# EasyEDA Pro project cameraboardschematic.epro

# Schematic CameraBoardSchematic
Board Name: 1 CameraBoard; Create Date: 2026-05-12; Page Name: P1; Project Name: To The Moon Together - An Amateur Sounding Rocket; Schematic Name: CameraBoardSchematic; Update Date: 2026-05-12; Company: EasyEDA.com; Page Size: A4; Version: V1.0
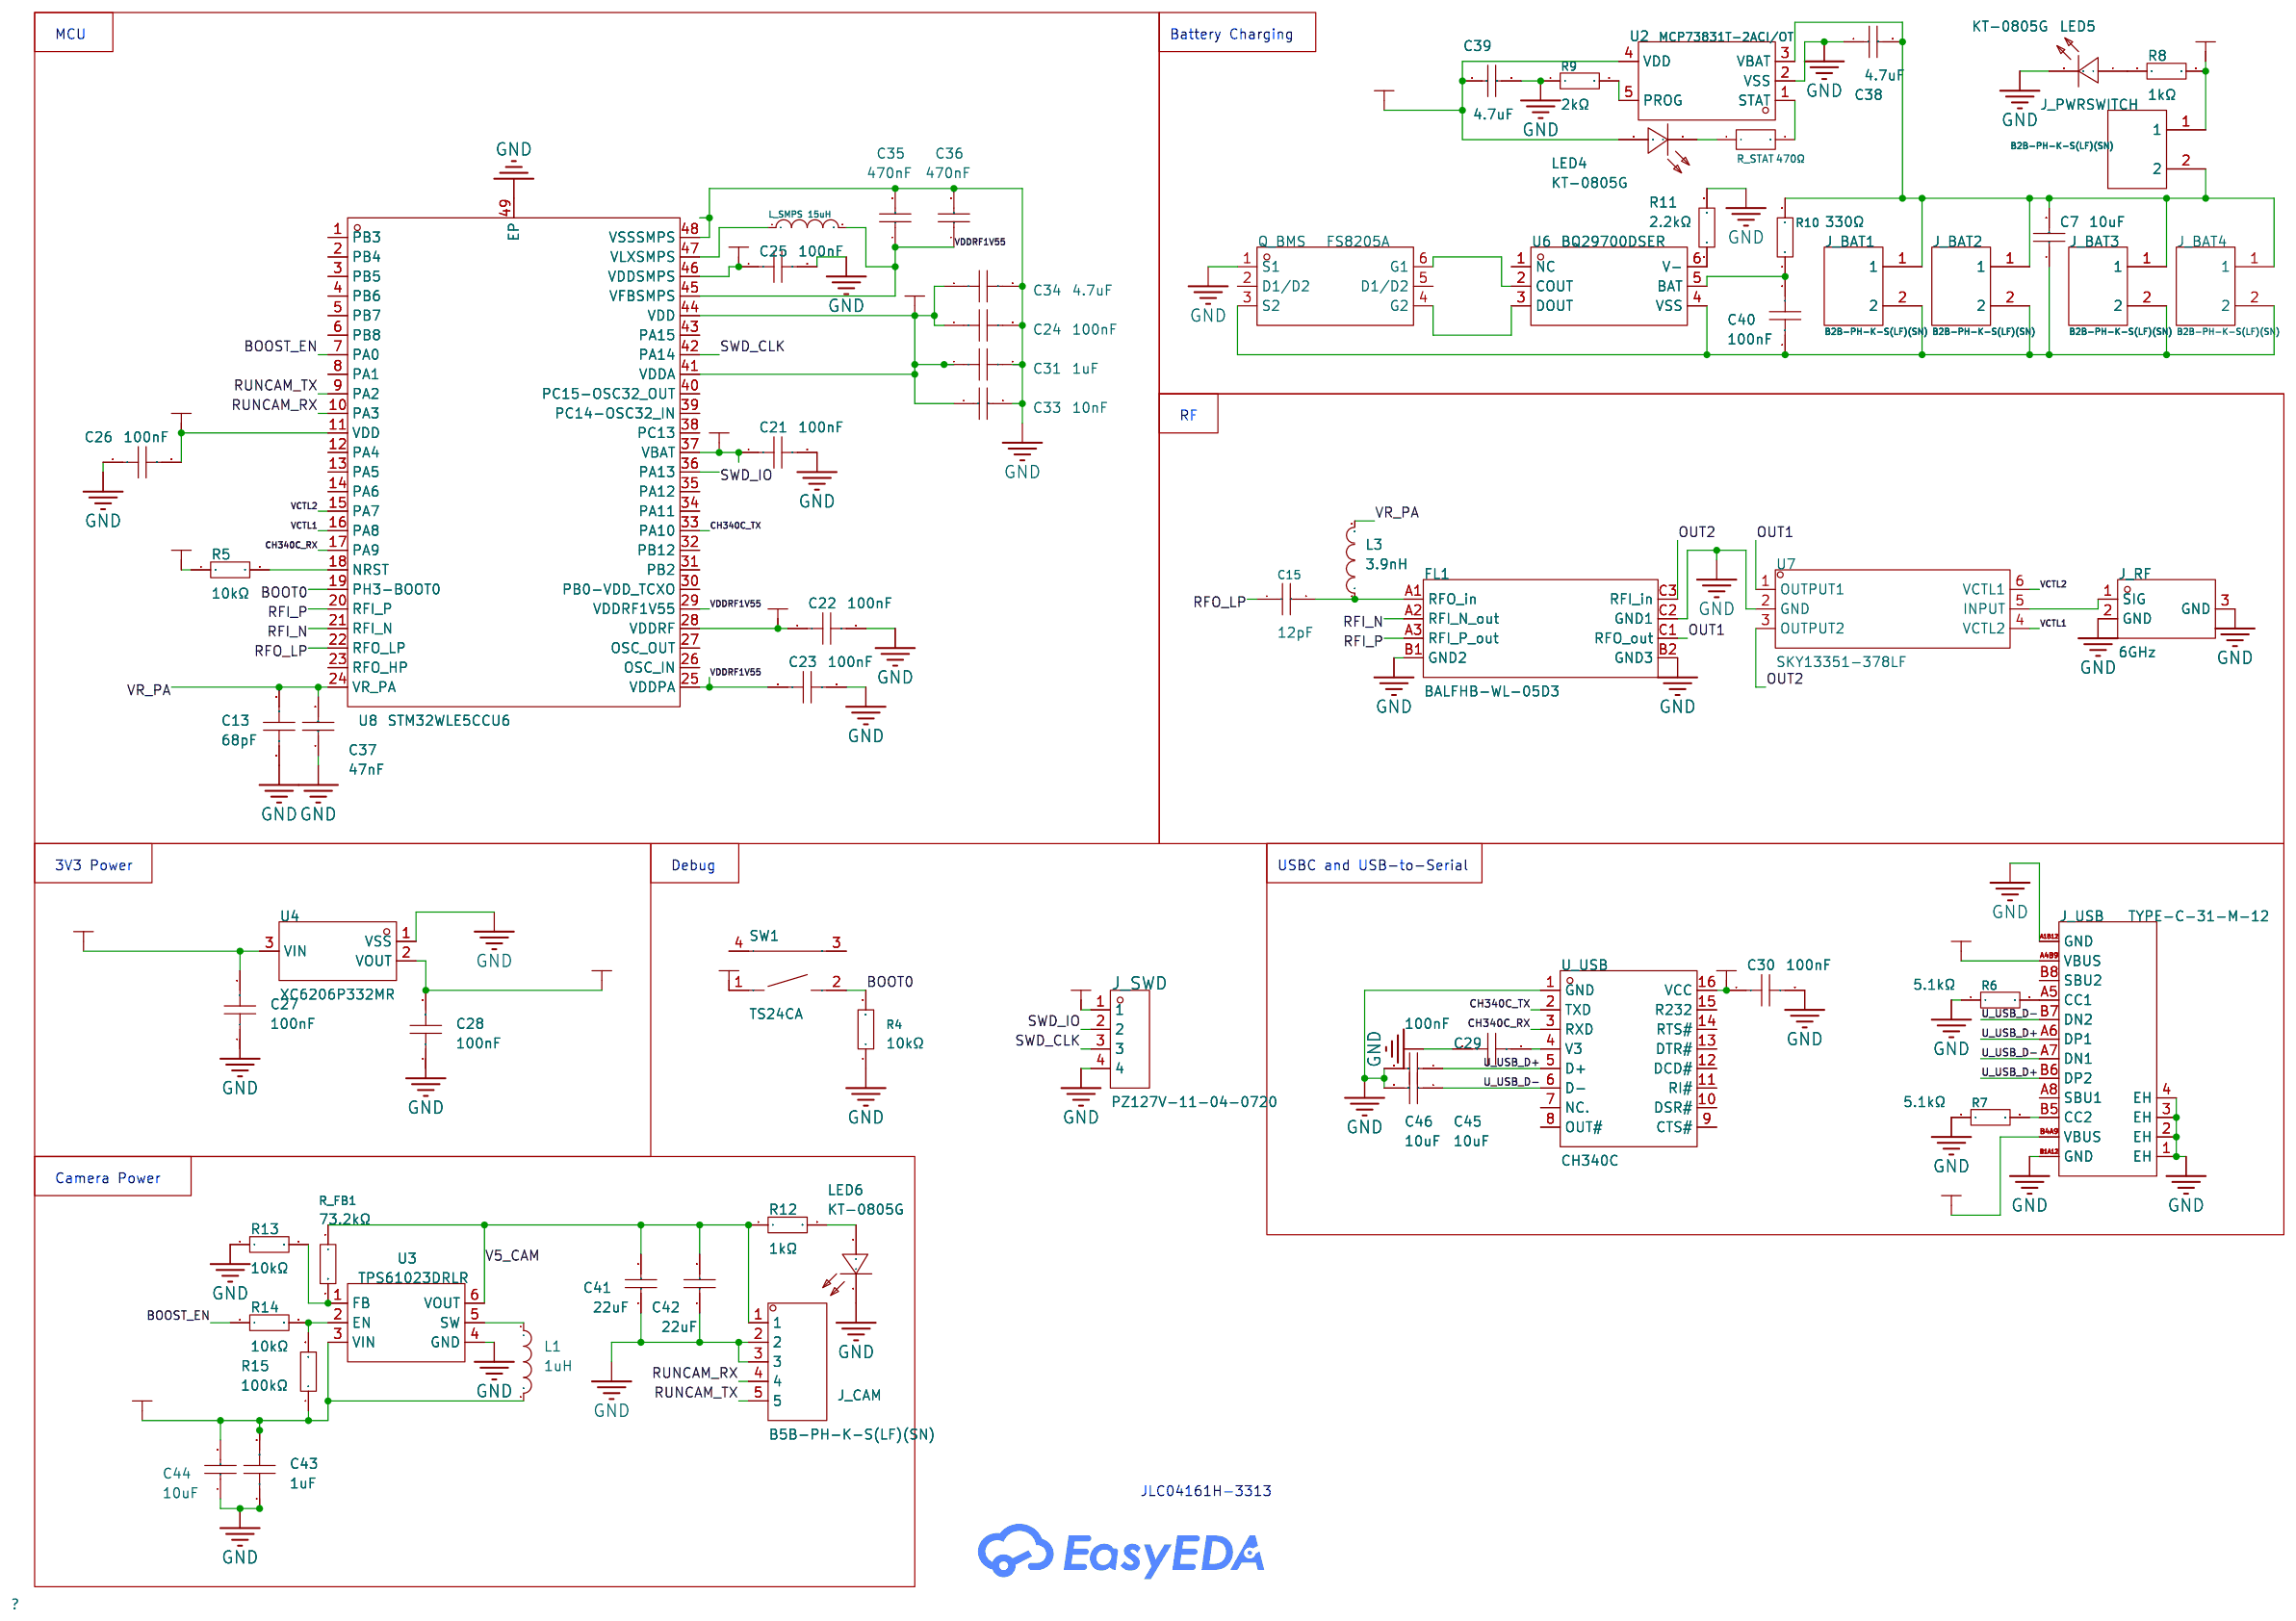
[diagram p0: schematic sheet]

## Parts
C7  10uF  [C0402]
C13  68pF  [C0402]
C15  12pF  [C0402]  (no BOM)
C21  100nF  [C0402]
C22  100nF  [C0402]
C23  100nF  [C0402]
C24  100nF  [C0402]
C25  100nF  [C0402]
C26  100nF  [C0402]
C27  100nF  [C0402]
C28  100nF  [C0402]
C29  100nF  [C0402]
C30  100nF  [C0402]
C31  1uF  [C0402]
C33  10nF  [C0402]
C34  4.7uF  [C0402]
C35  470nF  [C0603]
C36  470nF  [C0603]
C37  47nF  [C0402]
C38  4.7uF  [C1206]
C39  4.7uF  [C1206]
C40  100nF  [C0402]
C41  22uF  [C1206]
C42  22uF  [C1206]
C43  1uF  [C0402]
C44  10uF  [C0402]
C45  10uF  [C0402]
C46  10uF  [C0402]
FL1  BALFHB-WL-05D3  [CSPG-8_L2.1-W1.8_BALFHB-WL-03D3]
J_BAT1  B2B-PH-K-S(LF)(SN)  [CONN-TH_B2B-PH-K-S]
J_BAT2  B2B-PH-K-S(LF)(SN)  [CONN-TH_B2B-PH-K-S]
J_BAT3  B2B-PH-K-S(LF)(SN)  [CONN-TH_B2B-PH-K-S]
J_BAT4  B2B-PH-K-S(LF)(SN)  [CONN-TH_B2B-PH-K-S]
J_CAM  B5B-PH-K-S(LF)(SN)  [CONN-TH_B5B-PH-K-S-LF-SN]
J_PWRSWITCH  B2B-PH-K-S(LF)(SN)  [CONN-TH_B2B-PH-K-S]
J_RF  6GHz  [IPEX-SMD_BWIPX-1-001E]
J_SWD  PZ127V-11-04-0720  [HDR-TH_4P-P1.27-V-M]
J_USB  TYPE-C-31-M-12  [USB-C_SMD-TYPE-C-31-M-12_1]
L1  1uH  [L0603]
L3  3.9nH  [IND-SMD_L1.0-W0.5-2]  (no BOM)
L_SMPS  15uH  [IND-SMD_L2.5-W2.0]
LED4  KT-0805G  [LED0805-R-RD]
LED5  KT-0805G  [LED0805-R-RD]
LED6  KT-0805G  [LED0805-R-RD]
Q_BMS  FS8205A  [SOT-23-6_L2.9-W1.6-P0.95-LS2.8-BR]
R4  10kΩ  [R0402]
R5  10kΩ  [R0402]
R6  5.1kΩ  [R0402]
R7  5.1kΩ  [R0402]
R8  1kΩ  [R0402]
R9  2kΩ  [R0402]
R10  330Ω  [R0805]
R11  2.2kΩ  [R0805]
R12  1kΩ  [R0402]
R13  10kΩ  [R0402]
R14  10kΩ  [R0402]
R15  100kΩ  [R1206]
R_FB1  73.2kΩ  [R0402]
R_STAT  470Ω  [R0402]
SW1  TS24CA  [SW-SMD_2P-TS24CA]
U2  MCP73831T-2ACI/OT  [SOT-23-5_L3.0-W1.7-P0.95-LS2.8-BL]
U3  TPS61023DRLR  [SOT-563_L1.6-W1.2-P0.50-LS1.6-BR]
U4  XC6206P332MR  [SOT-23-3_L3.0-W1.7-P0.95-LS2.9-BR]
U6  BQ29700DSER  [WSON-6_L1.5-W1.5-P0.50-TL]
U7  SKY13351-378LF  [DFN-6_L1.0-W1.0-P0.35-BL-EP0.15]
U8  STM32WLE5CCU6  [UFQFPN-48_L7.0-W7.0-P0.50-BL-EP5.6]
U_USB  CH340C  [SOP-16_L10.0-W3.9-P1.27-LS6.0-BL]

## Library data of the parts
C7 C44-C46 = CL05A106MQ5NUNC: Capacitance:10uF Tolerance:±20% Tolerance:±20% Voltage Rating:6.3V Temperature Coefficient:X5R; LCSC Part Name: 10uF ±20% 6.3V; Supplier Part: C15525; Manufacturer: SAMSUNG(三星); Supplier Footprint: 0402; JLCPCB Part Class: Basic Part; Datasheet: https://item.szlcsc.com/datasheet/CL05A106MQ5NUNC/16204.html; Supplier: LCSC; Tolerance: ±20%; Voltage Rating: 6.3V; Temperature Coefficient: X5R
C13 = 0402CG680J500NT: Capacitance:68pF Tolerance:±5% Tolerance:±5% Voltage Rating:50V Temperature Coefficient:C0G; LCSC Part Name: 68pF ±5% 50V; Supplier Part: C190580; Manufacturer: FH(风华); Supplier Footprint: 0402; JLCPCB Part Class: Extended Part; Datasheet: https://item.szlcsc.com/datasheet/0402CG680J500NT/211111.html; Supplier: LCSC; Tolerance: ±5%; Voltage Rating: 50V; Temperature Coefficient: C0G
C15 = CC0402JRNPO9BN120: Capacitance:12pF Tolerance:±5% Tolerance:±5% Voltage Rating:50V Temperature Coefficient:NP0; LCSC Part Name: 12pF ±5% 50V; Supplier Part: C106201; Manufacturer: YAGEO(国巨); Supplier Footprint: 0402; JLCPCB Part Class: Extended Part; Datasheet: https://item.szlcsc.com/datasheet/CC0402JRNPO9BN120/107416.html; Supplier: LCSC; Tolerance: ±5%; Voltage Rating: 50V; Temperature Coefficient: NP0
C21-C30 C40 = CL05B104KO5NNNC: Capacitance:100nF Tolerance:±10% Tolerance:±10% Voltage Rating:16V Temperature Coefficient:X7R; LCSC Part Name: 100nF ±10% 16V; Supplier Part: C1525; Manufacturer: SAMSUNG(三星); Supplier Footprint: 0402; JLCPCB Part Class: Basic Part; Datasheet: https://item.szlcsc.com/datasheet/CL05B104KO5NNNC/1877.html; Supplier: LCSC; Tolerance: ±10%; Voltage Rating: 16V; Temperature Coefficient: X7R
C31 C43 = CL05A105KA5NQNC: Capacitance:1uF Tolerance:±10% Tolerance:±10% Voltage Rating:25V Temperature Coefficient:X5R; LCSC Part Name: 1uF ±10% 25V; Supplier Part: C52923; Manufacturer: SAMSUNG(三星); Supplier Footprint: 0402; JLCPCB Part Class: Basic Part; Datasheet: https://item.szlcsc.com/datasheet/CL05A105KA5NQNC/53938.html; Supplier: LCSC; Tolerance: ±10%; Voltage Rating: 25V; Temperature Coefficient: X5R
C33 = CL05B103KB5NNNC: Capacitance:10nF Tolerance:±10% Tolerance:±10% Voltage Rating:50V Temperature Coefficient:X7R; LCSC Part Name: 10nF ±10% 50V; Supplier Part: C15195; Manufacturer: SAMSUNG(三星); Supplier Footprint: 0402; JLCPCB Part Class: Basic Part; Datasheet: https://item.szlcsc.com/datasheet/CL05B103KB5NNNC/15869.html; Supplier: LCSC; Tolerance: ±10%; Voltage Rating: 50V; Temperature Coefficient: X7R
C34 = CL05A475MP5NRNC: Capacitance:4.7uF Tolerance:±20% Tolerance:±20% Voltage Rating:10V Temperature Coefficient:X5R; LCSC Part Name: 4.7uF ±20% 10V; Supplier Part: C23733; Manufacturer: SAMSUNG(三星); Supplier Footprint: 0402; JLCPCB Part Class: Basic Part; Datasheet: https://item.szlcsc.com/datasheet/CL05A475MP5NRNC/24469.html; Supplier: LCSC; Tolerance: ±20%; Voltage Rating: 10V; Temperature Coefficient: X5R
C35 C36 = CL10B474KA8NNNC: Capacitance:470nF Tolerance:±10% Tolerance:±10% Voltage Rating:25V Temperature Coefficient:X7R; LCSC Part Name: 470nF ±10% 25V; Supplier Part: C1623; Manufacturer: SAMSUNG(三星); Supplier Footprint: 0603; JLCPCB Part Class: Basic Part; Datasheet: https://item.szlcsc.com/datasheet/CL10B474KA8NNNC/1975.html; Supplier: LCSC; Tolerance: ±10%; Voltage Rating: 25V; Temperature Coefficient: X7R
C37 = 0402B473K500NT: Capacitance:47nF Tolerance:±10% Tolerance:±10% Voltage Rating:50V Temperature Coefficient:X7R; LCSC Part Name: 47nF ±10% 50V; Supplier Part: C82219; Manufacturer: FH(风华); Supplier Footprint: 0402; JLCPCB Part Class: Extended Part; Datasheet: https://item.szlcsc.com/datasheet/0402B473K500NT/83376.html; Supplier: LCSC; Tolerance: ±10%; Voltage Rating: 50V; Temperature Coefficient: X7R
C38 C39 = CL31B475KAHNNNE: Capacitance:4.7uF Tolerance:±10% Tolerance:±10% Voltage Rating:25V Temperature Coefficient:X7R; LCSC Part Name: 4.7uF ±10% 25V; Supplier Part: C1872; Manufacturer: SAMSUNG(三星); Supplier Footprint: 1206; JLCPCB Part Class: Extended Part; Datasheet: https://item.szlcsc.com/datasheet/CL31B475KAHNNNE/2224.html; Supplier: LCSC; Tolerance: ±10%; Voltage Rating: 25V; Temperature Coefficient: X7R
C41 C42 = CL31A226KAHNNNE: Capacitance:22uF Tolerance:±10% Tolerance:±10% Voltage Rating:25V Temperature Coefficient:X5R; LCSC Part Name: 22uF ±10% 25V; Supplier Part: C12891; Manufacturer: SAMSUNG(三星); Supplier Footprint: 1206; JLCPCB Part Class: Basic Part; Datasheet: https://item.szlcsc.com/datasheet/CL31A226KAHNNNE/13537.html; Supplier: LCSC; Tolerance: ±10%; Voltage Rating: 25V; Temperature Coefficient: X5R
FL1 = BALFHB-WL-05D3: Filter Type:Bandpass Frequency - Center:- Cut-Off Frequency:- Absolute Bandwidth:862MHz~928MHz Absolute Bandwidth:862MHz~928MHz Relative Bandwidth:- Relative Bandwidth:- Attenuation:42dB；56dB；48dB；35dB；27dB；64dB；40dB；39dB；33dB Impedance:50Ω Ripple:- Inser; LCSC Part Name: 50Ω 标称输入/共轭匹配平衡-不平衡转换器至 QFN-4L STM32WL，低功耗模式，862 - 928 MHz，带集成谐波滤波器; Supplier Part: C5350080; Manufacturer: ST(意法半导体); Supplier Footprint: CSPG-8; JLCPCB Part Class: Extended Part; Datasheet: https://item.szlcsc.com/datasheet/BALFHB-WL-05D3/6136634.html; Supplier: LCSC; Filter Type: Bandpass; Absolute Bandwidth: 862MHz~928MHz; Attenuation: 42dB；56dB；48dB；35dB；27dB；64dB；40dB；39dB；33dB; Impedance: 50Ω; Insertion Loss: 1.4dB; Operating Temperature: -40℃~+105℃
J_BAT1-J_BAT4 J_PWRSWITCH = B2B-PH-K-S(LF)(SN): Pins Structure:1x2P Pitch:2mm Mounting Type:Through Hole Reference Series:PH Number of Pins:2P Number of Rows:1 Number of PINs Per Row:2 Row Spacing:- Current Rating:2A Contact Material:Brass Contact Plating:Tin Operating Temperature:-25℃~+85℃ Operating T; LCSC Part Name: 1x2P 间距:2mm 直插 系列:PH; Supplier Part: C131337; Manufacturer: JST; Supplier Footprint: 插件,P=2mm; JLCPCB Part Class: Extended Part; Datasheet: https://item.szlcsc.com/datasheet/B2B-PH-K-S(LF)(SN)/142630.html; Supplier: LCSC; Pins Structure: 1x2P; Pitch: 2mm; Mounting Type: Through Hole; Reference Series: PH; Number of Pins: 2P; Number of Rows: 1; Number of PINs Per Row: 2; Current Rating: 2A; Contact Material: Brass; Contact Plating: Tin; Operating Temperature: -25℃~+85℃; Voltage Rating: 100V; Plastic Material: PA66; Flame Retardant Rating: UL94V-0; Supplementary Features: K Pin; Color: White; Z-Height of the Board: 6mm; X-Length of Bottom Edge on Board (Spacing Line): 5.9mm; Y-Width of Bottom Edge on Board: 4.5mm
J_CAM = B5B-PH-K-S(LF)(SN): Pins Structure:1x5P Pitch:2mm Mounting Type:Through Hole Reference Series:PH Number of Pins:5P Number of Rows:1 Number of PINs Per Row:5 Row Spacing:- Current Rating:2A Contact Material:Brass Contact Plating:Tin Operating Temperature:-25℃~+85℃ Operating T; LCSC Part Name: 1x5P 间距:2mm 直插 系列:PH; Supplier Part: C157993; Manufacturer: JST; Supplier Footprint: 插件,P=2mm; JLCPCB Part Class: Extended Part; Datasheet: https://item.szlcsc.com/datasheet/B5B-PH-K-S(LF)(SN)/169341.html; Supplier: LCSC; Pins Structure: 1x5P; Pitch: 2mm; Mounting Type: Through Hole; Reference Series: PH; Number of Pins: 5P; Number of Rows: 1; Number of PINs Per Row: 5; Current Rating: 2A; Contact Material: Brass; Contact Plating: Tin; Operating Temperature: -25℃~+85℃; Voltage Rating: 100V; Plastic Material: PA66; Flame Retardant Rating: UL94V-0; Supplementary Features: K Pin; Color: White; Z-Height of the Board: 6mm; X-Length of Bottom Edge on Board (Spacing Line): 11.9mm; Y-Width of Bottom Edge on Board: 4.5mm
J_RF = BWIPX-1-001E: Connector Type:Board Side Interface:Male Pin Number of Ports:1 Interface Diameter:2mm Interface Length/Height:1.25mm Frequency:6GHz RF Series:IPEX Impedance:50Ω Style:- Operating Temperature Range:-40℃~+85℃ Operating Temperature Range:-40℃~+85℃; LCSC Part Name: 内针 IPEX; Supplier Part: C496552; Manufacturer: BAT WIRELESS(蝙蝠无线); Supplier Footprint: SMD; JLCPCB Part Class: Extended Part; Datasheet: https://item.szlcsc.com/datasheet/BWIPX-1-001E/508501.html; Supplier: LCSC; Connector Type: Board Side; Interface: Male Pin; Number of Ports: 1; Interface Diameter: 2mm; Interface Length/Height: 1.25mm; RF Series: IPEX; Impedance: 50Ω; Operating Temperature Range: -40℃~+85℃
J_SWD = PZ127V-11-04-0720: Pin Structure:1x4P Pitch:1.27mm Row Spacing:- Circluar Pins/Square Pins:Pin Header Mounting Type:Through Hole Number of Rows:1 Number of Pins:4P Current Rating:1A Voltage Rating (Max):- Length of Mating Pin:3.9mm Insulation Height:1mm Length of End Connec; LCSC Part Name: 1x4P 间距:1.27mm 方针 直插; Supplier Part: C541879; Manufacturer: XFCN(兴飞); Supplier Footprint: 插件,P=1.27mm; JLCPCB Part Class: Extended Part; Datasheet: https://item.szlcsc.com/datasheet/PZ127V-11-04-0720/562500.html; Supplier: LCSC; Pin Structure: 1x4P; Pitch: 1.27mm; Circluar Pins/Square Pins: Pin Header; Mounting Type: Through Hole; Number of Rows: 1; Number of Pins: 4P; Current Rating: 1A; Length of Mating Pin: 3.9mm; Insulation Height: 1mm; Length of End Connection Pin: 2.3mm; Contact Material: Brass; Operating Temperature: -40℃~+105℃; Color: Black
J_USB = TYPE-C-31-M-12: Connector Type:Type-C Protocol Standard:- Gender:Female Mounting Type:Surface Mount, Right Angle Number of Contacts:16P Number of Ports:1 Current Rating-Power:5A Voltage Rating:20V Connect-Disconnect Life:10,000 cycles Length:7.35mm Operating Temperature:; LCSC Part Name: Type-C 母 卧贴; Supplier Part: C165948; Manufacturer: 韩国韩荣; Supplier Footprint: SMD; JLCPCB Part Class: Extended Part; Datasheet: https://item.szlcsc.com/datasheet/TYPE-C-31-M-12/177331.html; Supplier: LCSC; Connector Type: Type-C; Gender: Female; Mounting Type: Surface Mount, Right Angle; Number of Contacts: 16P; Number of Ports: 1; Current Rating-Power: 5A; Voltage Rating: 20V; Connect-Disconnect Life: 10,000 cycles; Length: 7.35mm; Operating Temperature: -30℃~+80℃
L1 = YL160808-1R0K: Inductance:1uH Tolerance:±10% Tolerance:±10% Current Rating:25mA Current - Saturation (Isat):- DC Resistance(DCR):600mΩ Q @ Frequency:35@10MHz Frequency - Self Resonant:75MHz Ratings:-; LCSC Part Name: 1uH ±10%; Supplier Part: C2839970; Manufacturer: YJYCOIN(益嘉源); Supplier Footprint: 0603; JLCPCB Part Class: Extended Part; Datasheet: https://item.szlcsc.com/datasheet/YL160808-1R0K/3017530.html; Supplier: LCSC; Tolerance: ±10%; Current Rating: 25mA; DC Resistance(DCR): 600mΩ; Q @ Frequency: 35@10MHz; Frequency - Self Resonant: 75MHz
L3 = LQW15AN3N9B00D: Inductance:3.9nH Current Rating:750mA Current - Saturation(Isat):- DC Resistance(DCR):70mΩ Type:Unshielded Inductor Ratings:-; Supplier Part: C98062; Manufacturer: muRata(村田); Supplier Footprint: 0402; JLCPCB Part Class: Extended Part; Datasheet: https://item.szlcsc.com/datasheet/LQW15AN3N9B00D/99271.html; Supplier: LCSC; Current Rating: 750mA; DC Resistance(DCR): 70mΩ; Type: Unshielded Inductor
L_SMPS = XRNR252010-15uH/M: Inductance: Tolerance:±20% Tolerance:±20% Current Rating:360mA Current - Saturation(Isat):460mA DC Resistance(DCR): Type:Magnetic Adhesive Inductor; LCSC Part Name: 15uH ±20% 460mA 磁胶电感; Supplier Part: C5289261; Manufacturer: XR(祥如); Supplier Footprint: 1008; JLCPCB Part Class: Extended Part; Datasheet: https://atta.szlcsc.com/upload/public/pdf/source/20221129/97CB96792DB49F57B0C289F29470F078.pdf; Supplier: LCSC; Tolerance: ±20%; Current Rating: 360mA; Current - Saturation(Isat): 460mA; Type: Magnetic Adhesive Inductor
LED4-LED6 = KT-0805G: Lamp Holder Type:- Illumination Color:Emerald Green Voltage - Forward(Vf):2.6V~3.1V Voltage - Forward(Vf):2.6V~3.1V Power(Watts):100mW Forward Current:5mA Wavelength - Dominant:513nm~528nm Wavelength - Dominant:513nm~528nm Peak Wavelength:525nm Diode Conf; LCSC Part Name: 0805 翠绿 高亮; Supplier Part: C2297; Manufacturer: KENTO; Supplier Footprint: 0805; JLCPCB Part Class: Basic Part; Datasheet: https://item.szlcsc.com/datasheet/KT-0805G/2670.html; Supplier: LCSC; Illumination Color: Emerald Green; Voltage - Forward(Vf): 2.6V~3.1V; Power(Watts): 100mW; Forward Current: 5mA; Wavelength - Dominant: 513nm~528nm; Peak Wavelength: 525nm; Diode Configuration: Discrete Diode; Lens Color: Water Clear; Luminous Intensity: 430mcd; Viewing Angle: 120°; Operating Temperature: -40℃~+85℃
Q_BMS = FS8205A_C2830320: Type:2 N-Channel Drain Source Voltage (Vdss): Continuous Drain Current (Id): Drain Source On Resistance (RDS(on)@Vgs,Id):25mΩ@2.5V,3A Power Dissipation (Pd): Gate Threshold Voltage (Vgs(th)@Id):500mV@250uA Total Gate Charge (Qg@Vgs):5.7nC@10V Input Capaci; LCSC Part Name: 2个N沟道 耐压:20V 电流:6A; Supplier Part: C2830320; Manufacturer: TECH PUBLIC(台舟); Supplier Footprint: SOT-23-6; JLCPCB Part Class: Extended Part; Datasheet: https://atta.szlcsc.com/upload/public/pdf/source/20210810/F53B6D4E8755A1F8E11BAF814CE98E6A.pdf; Supplier: LCSC; Type: 2 N-Channel; Drain Source On Resistance (RDS(on)@Vgs,Id): 25mΩ@2.5V,3A; Gate Threshold Voltage (Vgs(th)@Id): 500mV@250uA; Total Gate Charge (Qg@Vgs): 5.7nC@10V; Input Capacitance (Ciss@Vds): 466pF@10V; Reverse Transfer Capacitance (Crss@Vds): 58pF@10V; Operating Temperature: -55℃~+150℃
R4 = RC0402JR-0710KL: Type:Thick Film Resistors Resistance:10kΩ Tolerance:±5% Tolerance:±5% Power(Watts):62.5mW Voltage-Supply(Max):50V Temperature Coefficient:±100ppm/℃ Temperature Coefficient:±100ppm/℃ Operating Temperature:-55℃~+155℃ Operating Temperature:-55℃~+155℃; LCSC Part Name: 厚膜电阻 10kΩ ±5% 62.5mW; Supplier Part: C60489; Manufacturer: YAGEO(国巨); Supplier Footprint: 0402; JLCPCB Part Class: Extended Part; Datasheet: https://item.szlcsc.com/datasheet/RC0402JR-0710KL/61541.html; Supplier: LCSC; Type: Thick Film Resistors; Tolerance: ±5%; Power(Watts): 62.5mW; Voltage-Supply(Max): 50V; Temperature Coefficient: ±100ppm/℃; Operating Temperature: -55℃~+155℃
R5 R13 R14 = 0402WGF1002TCE: Type:Thick Film Resistor Resistance:10kΩ Tolerance:±1% Tolerance:±1% Power(Watts):62.5mW Voltage-Supply(Max):50V Temperature Coefficient:±100ppm/℃ Temperature Coefficient:±100ppm/℃ Operating Temperature:-55℃~+155℃ Operating Temperature:-55℃~+155℃; LCSC Part Name: 10kΩ ±1% 62.5mW 厚膜电阻; Supplier Part: C25744; Manufacturer: UNI-ROYAL(厚声); Supplier Footprint: 0402; JLCPCB Part Class: Basic Part; Datasheet: https://item.szlcsc.com/datasheet/0402WGF1002TCE/26487.html; Supplier: LCSC; Type: Thick Film Resistor; Tolerance: ±1%; Power(Watts): 62.5mW; Voltage-Supply(Max): 50V; Temperature Coefficient: ±100ppm/℃; Operating Temperature: -55℃~+155℃
R6 R7 = 0402WGF5101TCE: Type:Thick Film Resistor Resistance:5.1kΩ Tolerance:±1% Tolerance:±1% Power(Watts):62.5mW Voltage-Supply(Max):50V Temperature Coefficient:±100ppm/℃ Temperature Coefficient:±100ppm/℃ Operating Temperature:-55℃~+155℃ Operating Temperature:-55℃~+155℃; LCSC Part Name: 5.1kΩ ±1% 62.5mW 厚膜电阻; Supplier Part: C25905; Manufacturer: UNI-ROYAL(厚声); Supplier Footprint: 0402; JLCPCB Part Class: Basic Part; Datasheet: https://item.szlcsc.com/datasheet/0402WGF5101TCE/26648.html; Supplier: LCSC; Type: Thick Film Resistor; Tolerance: ±1%; Power(Watts): 62.5mW; Voltage-Supply(Max): 50V; Temperature Coefficient: ±100ppm/℃; Operating Temperature: -55℃~+155℃
R8 R12 = 0402WGF1001TCE: Type:Thick Film Resistor Resistance:1kΩ Tolerance:±1% Tolerance:±1% Power(Watts):62.5mW Voltage-Supply(Max):50V Temperature Coefficient:±100ppm/℃ Temperature Coefficient:±100ppm/℃ Operating Temperature:-55℃~+155℃ Operating Temperature:-55℃~+155℃; LCSC Part Name: 1kΩ ±1% 62.5mW 厚膜电阻; Supplier Part: C11702; Manufacturer: UNI-ROYAL(厚声); Supplier Footprint: 0402; JLCPCB Part Class: Basic Part; Datasheet: https://item.szlcsc.com/datasheet/0402WGF1001TCE/12256.html; Supplier: LCSC; Type: Thick Film Resistor; Tolerance: ±1%; Power(Watts): 62.5mW; Voltage-Supply(Max): 50V; Temperature Coefficient: ±100ppm/℃; Operating Temperature: -55℃~+155℃
R9 = 0402WGF2001TCE: Type:Thick Film Resistors Resistance:2kΩ Tolerance:±1% Tolerance:±1% Power(Watts): Overload Voltage (Max): Temperature Coefficient:±100ppm/℃ Temperature Coefficient:±100ppm/℃ Operating Temperature Range:-55℃~+155℃ Operating Temperature Range:-55℃~+155℃; LCSC Part Name: 2kΩ ±1% 62.5mW 厚膜电阻; Supplier Part: C4109; Manufacturer: UNI-ROYAL(厚声); Supplier Footprint: 0402; JLCPCB Part Class: Basic Part; Datasheet: https://atta.szlcsc.com/upload/public/pdf/source/20200306/C422600_1E6D84923E4A46A82E41ADD87F860B5C.pdf; Supplier: LCSC; Type: Thick Film Resistors; Tolerance: ±1%; Temperature Coefficient: ±100ppm/℃; Operating Temperature Range: -55℃~+155℃
R10 = 0805W8F3300T5E: Type:Thick Film Resistor Resistance:330Ω Tolerance:±1% Tolerance:±1% Power(Watts):125mW Voltage-Supply(Max):150V Temperature Coefficient:±100ppm/℃ Temperature Coefficient:±100ppm/℃ Operating Temperature:-55℃~+155℃ Operating Temperature:-55℃~+155℃; LCSC Part Name: 330Ω ±1% 125mW 厚膜电阻; Supplier Part: C17630; Manufacturer: UNI-ROYAL(厚声); Supplier Footprint: 0805; JLCPCB Part Class: Basic Part; Datasheet: https://item.szlcsc.com/datasheet/0805W8F3300T5E/18318.html; Supplier: LCSC; Type: Thick Film Resistor; Tolerance: ±1%; Power(Watts): 125mW; Voltage-Supply(Max): 150V; Temperature Coefficient: ±100ppm/℃; Operating Temperature: -55℃~+155℃
R11 = 0805W8F2201T5E_C17520: Type:Thick Film Resistor Resistance:2.2kΩ Tolerance:±1% Tolerance:±1% Power(Watts):125mW Voltage-Supply(Max):150V Temperature Coefficient:±100ppm/℃ Temperature Coefficient:±100ppm/℃ Operating Temperature:-55℃~+155℃ Operating Temperature:-55℃~+155℃; LCSC Part Name: 2.2kΩ ±1% 125mW 厚膜电阻; Supplier Part: C17520; Manufacturer: UNI-ROYAL(厚声); Manufacturer Part: 0805W8F2201T5E; Supplier Footprint: 0805; JLCPCB Part Class: Basic Part; Datasheet: https://item.szlcsc.com/datasheet/0805W8F2201T5E/18208.html; Supplier: LCSC; Type: Thick Film Resistor; Tolerance: ±1%; Power(Watts): 125mW; Voltage-Supply(Max): 150V; Temperature Coefficient: ±100ppm/℃; Operating Temperature: -55℃~+155℃
R15 = 1206W4F1003T5E: Type:Thick Film Resistor Resistance:100kΩ Tolerance:±1% Tolerance:±1% Power(Watts):250mW Voltage-Supply(Max):200V Temperature Coefficient:±100ppm/℃ Temperature Coefficient:±100ppm/℃ Operating Temperature:-55℃~+155℃ Operating Temperature:-55℃~+155℃; LCSC Part Name: 100kΩ ±1% 250mW 厚膜电阻; Supplier Part: C17900; Manufacturer: UNI-ROYAL(厚声); Supplier Footprint: 1206; JLCPCB Part Class: Basic Part; Datasheet: https://item.szlcsc.com/datasheet/1206W4F1003T5E/18588.html; Supplier: LCSC; Type: Thick Film Resistor; Tolerance: ±1%; Power(Watts): 250mW; Voltage-Supply(Max): 200V; Temperature Coefficient: ±100ppm/℃; Operating Temperature: -55℃~+155℃
R_FB1 = 0402WGF7322TCE: Type:Thick Film Resistor Resistance:73.2kΩ Tolerance:±1% Tolerance:±1% Power(Watts):62.5mW Voltage-Supply(Max):50V Temperature Coefficient:±100ppm/℃ Temperature Coefficient:±100ppm/℃ Operating Temperature:-55℃~+155℃ Operating Temperature:-55℃~+155℃; LCSC Part Name: 73.2kΩ ±1% 62.5mW 厚膜电阻; Supplier Part: C26986; Manufacturer: UNI-ROYAL(厚声); Supplier Footprint: 0402; JLCPCB Part Class: Extended Part; Datasheet: https://item.szlcsc.com/datasheet/0402WGF7322TCE/27735.html; Supplier: LCSC; Type: Thick Film Resistor; Tolerance: ±1%; Power(Watts): 62.5mW; Voltage-Supply(Max): 50V; Temperature Coefficient: ±100ppm/℃; Operating Temperature: -55℃~+155℃
R_STAT = FRC0402F4700TS: Type:Thick Film Resistor Resistance:470Ω Tolerance:±1% Tolerance:±1% Power(Watts):62.5mW Voltage-Supply(Max):50V Temperature Coefficient:±100ppm/℃ Temperature Coefficient:±100ppm/℃ Operating Temperature:-55℃~+155℃ Operating Temperature:-55℃~+155℃; LCSC Part Name: 470Ω ±1% 62.5mW 厚膜电阻; Supplier Part: C2909361; Manufacturer: FOJAN(富捷); Supplier Footprint: 0402; JLCPCB Part Class: Extended Part; Supplier: LCSC; Type: Thick Film Resistor; Tolerance: ±1%; Power(Watts): 62.5mW; Voltage-Supply(Max): 50V; Temperature Coefficient: ±100ppm/℃; Operating Temperature: -55℃~+155℃
SW1 = TS24CA: Circuit:SPST Actuator Style:Rectangular Button Operating Force:1.6N Mounting Type:Surface Mount, Right Angle Length:4.7mm Width:1.9mm Switch Height:3.5mm with Bracket:Without Bracket Contact Current:50mA Voltage Rating:12V Actuator/Cap Color:Black With La; LCSC Part Name: 4.55*1.8*3.5mm 卧贴 轻触开关; Supplier Part: C393942; Manufacturer: SHOU HAN(首韩); Supplier Footprint: SMD,4.6x1.8mm; JLCPCB Part Class: Extended Part; Datasheet: https://item.szlcsc.com/datasheet/TS24CA/372554.html; Supplier: LCSC; Circuit: SPST; Actuator Style: Rectangular Button; Operating Force: 1.6N; Mounting Type: Surface Mount, Right Angle; Length: 4.7mm; Width: 1.9mm; Switch Height: 3.5mm; with Bracket: Without Bracket; Contact Current: 50mA; Voltage Rating: 12V; Actuator/Cap Color: Black; With Lamp: No; Termination Style: SMD(SMT) Tab; Life: 20,000 cycles; Operating Temperature: -20℃~+70℃
U2 = MCP73831T-2ACI/OT: The Chip Type:Charging IC Voltage - Supply:3.75V~6V Voltage - Supply:3.75V~6V Charge Current - Max:550mA Charging Saturation Voltage:4.2V End-Off Voltage:- Type of Battery:Lithium Battery Number of Cells:1 Number of Cells:1 Operating Temperature:-40℃~+85℃; LCSC Part Name: 单节锂离子/锂聚合物充电管理控制器; Supplier Part: C424093; Manufacturer: MICROCHIP(美国微芯); Supplier Footprint: SOT-23-5; JLCPCB Part Class: Extended Part; Datasheet: https://item.szlcsc.com/datasheet/MCP73831T-2ACI%252FOT/417116.html; Supplier: LCSC; The Chip Type: Charging IC; Voltage - Supply: 3.75V~6V; Charge Current - Max: 550mA; Charging Saturation Voltage: 4.2V; Type of Battery: Lithium Battery; Number of Cells: 1; Operating Temperature: -40℃~+85℃; Battery Temperature Detection: Not supported; Supply Current (Iq): 53uA
U3 = TPS61023DRLR: Function:Boost type Output Type:Adjustable Voltage - Supply:500mV~5.5V Voltage - Supply:500mV~5.5V Output Voltage:2.2V~5.5V Output Voltage:2.2V~5.5V Output Current:3A Frequency - Switching:1MHz Frequency - Switching:1MHz Operating Temperature:-40℃~+125℃@(; Supplier Part: C919459; Manufacturer: TI(德州仪器); Supplier Footprint: SOT-563; JLCPCB Part Class: Extended Part; Datasheet: https://www.ti.com.cn/cn/lit/ds/symlink/tps61023.pdf?ts=1728812468331&ref_url=https%253A%252F%252Fwww.ti.com.cn%252Fproduct%252Fcn%252FTPS61023; Supplier: LCSC; Function: Boost type; Output Type: Adjustable; Voltage - Supply: 500mV~5.5V; Output Voltage: 2.2V~5.5V; Output Current: 3A; Frequency - Switching: 1MHz; Operating Temperature: -40℃~+125℃@(TJ); Synchronous Rectifier: Yes; Number of Outputs: 1; Topology: Boost; Switch tube (built-in/external): Built-in
U4 = XC6206P332MR_C347376: Output Type:Fixed Voltage - Supply:8V Output Voltage:3.3V Output Voltage:3.3V Output Current:250mA Power Supply Rejection Ratio (PSRR):40dB@(1kHz) Voltage Dropout:240mV@(50mA) standby current:7uA Noise:- Features:Over Current Protection；Short Circuit Prot; LCSC Part Name: 高纹波抑制率、低功耗、低压差 CMOS 降压型电压稳压器; Supplier Part: C347376; Manufacturer: UMW(友台半导体); Supplier Footprint: SOT-23; JLCPCB Part Class: Extended Part; Datasheet: https://item.szlcsc.com/datasheet/XC6206P332MR/324036.html; Supplier: LCSC; Output Type: Fixed; Voltage - Supply: 8V; Output Voltage: 3.3V; Output Current: 250mA; Power Supply Rejection Ratio (PSRR): 40dB@(1kHz); Voltage Dropout: 240mV@(50mA); standby current: 7uA; Features: Over Current Protection；Short Circuit Protection; Operating Temperature: -25℃~+80℃@(Ta); Output Configuration: Positive; Number of Outputs: 1
U6 = BQ29700DSER: The Chip Type:Protection IC Voltage - Supply:1.5V~8V Voltage - Supply:1.5V~8V Charge Current - Max:- Charging Saturation Voltage:4.275V End-Off Voltage:2.8V Type of Battery:Lithium Battery Number of Cells:1 Number of Cells:1 Operating Temperature:-40℃~+85; LCSC Part Name: 单节锂离子和锂聚合物电池的经济型电压和电流保护集成电路; Supplier Part: C183096; Manufacturer: TI(德州仪器); Supplier Footprint: WSON-6(1.5x1.5); JLCPCB Part Class: Extended Part; Datasheet: https://www.ti.com/cn/lit/gpn/bq2970; Supplier: LCSC; The Chip Type: Protection IC; Voltage - Supply: 1.5V~8V; Charging Saturation Voltage: 4.275V; End-Off Voltage: 2.8V; Type of Battery: Lithium Battery; Number of Cells: 1; Operating Temperature: -40℃~+85℃; Battery Temperature Detection: Not supported; 0V Battery Charge: Support; Supply Current (Iq): 4uA
U7 = SKY13351-378LF: isolation:24dB Insertion loss:0.35dB Frequency range:20MHz~6GHz Frequency range:20MHz~6GHz Voltage - Supply:1.8V~5V Voltage - Supply:1.8V~5V operating temperature:-40℃~+85℃ operating temperature:-40℃~+85℃; LCSC Part Name: 20MHz至6.0GHzGaAsSPDT射频开关; Supplier Part: C129189; Manufacturer: SKYWORKS; Supplier Footprint: DFN-6-EP(1x1); JLCPCB Part Class: Extended Part; Datasheet: https://item.szlcsc.com/datasheet/SKY13351-378LF/140475.html; Supplier: LCSC; isolation: 24dB; Insertion loss: 0.35dB; Frequency range: 20MHz~6GHz; Voltage - Supply: 1.8V~5V; operating temperature: -40℃~+85℃
U8 = STM32WLE5CCU6: LCSC Part Name: Sub-GHz 无线微控制器。Arm Cortex-M4 @48 MHz，配备 256 KB 闪存，64 KB SRAM。LoRa、(G)FSK、(G)MSK、BPSK 调制方式。AES 256位。多协议系统级芯片。; Supplier Part: C2888218; Manufacturer: ST(意法半导体); Supplier Footprint: UFQFPN-48(7x7); JLCPCB Part Class: Extended Part; Datasheet: https://item.szlcsc.com/datasheet/STM32WLE5CCU6/3107723.html; Supplier: LCSC
U_USB = CH340C: Applications Function:Transceiver USB Protocol:USB 2.0 Voltage - Supply:3.3V；5V Voltage - Supply:3.3V；5V Data Rate:2Mbps Operating Temperature:-20℃~+70℃ Operating Temperature:-20℃~+70℃ Current - Supply:7mA Supply Current (Iq):50uA; LCSC Part Name: USB转串口芯片; Supplier Part: C84681; Manufacturer: WCH(南京沁恒); Supplier Footprint: SOP-16; JLCPCB Part Class: Extended Part; Datasheet: https://item.szlcsc.com/datasheet/CH340C/85852.html; Supplier: LCSC; Applications Function: Transceiver; USB Protocol: USB 2.0; Voltage - Supply: 3.3V；5V; Data Rate: 2Mbps; Operating Temperature: -20℃~+70℃; Current - Supply: 7mA; Supply Current (Iq): 50uA

## Nets
3V3: C21.1 C22.1 C24.1 C25.1 C26.2 C28.2 C30.1 C31.1 C33.1 C34.1 J_SWD.1 R5.1 SW1.1 U4.2(VOUT) U8.11(VDD) U8.28(VDDRF) U8.37(VBAT) U8.41(VDDA) U8.44(VDD) U8.46(VDDSMPS) U_USB.16(VCC)
GND: C13.1 C21.2 C22.2 C23.2 C24.2 C25.2 C26.1 C27.1 C28.1 C29.1 C30.2 C31.2 C33.2 C34.2 C35.2 C36.2 C37.1 C38.1 C39.2 C41.1 C42.1 C43.1 C44.1 C45.2 C46.2 FL1.B1(GND2) FL1.B2(GND3) FL1.C2(GND1) J_CAM.2 J_CAM.3 J_RF.2(GND) J_RF.3(GND) J_SWD.4 J_USB.1(EH) J_USB.2(EH) J_USB.3(EH) J_USB.4(EH) J_USB.A1B12(GND) J_USB.B1A12(GND) LED5.2(K) LED6.2(K) Q_BMS.1(S1) R4.1 R6.1 R7.1 R9.1 R11.2 R13.1 U2.2(VSS) U3.4(GND) U4.1(VSS) U7.2(GND) U8.48(VSSSMPS) U8.49(EP) U_USB.1(GND)
V5_CAM: C41.2 C42.2 J_CAM.1 R12.1 R_FB1.1 U3.6(VOUT)
VBAT: C27.2 C43.2 C44.2 J_PWRSWITCH.1 L1.2 R8.2 R15.1 U3.3(VIN) U4.3(VIN)
VBUS_5V: C39.1 J_USB.A4B9(VBUS) J_USB.B4A9(VBUS) LED4.1(A) U2.4(VDD)
VDDRF1V55: C23.1 C35.1 C36.1 L_SMPS.2 U8.25(VDDPA) U8.29(VDDRF1V55) U8.45(VFBSMPS)
BOOST_EN: R14.1 U8.7(PA0)
BOOT0: R4.2 SW1.2 U8.19(PH3-BOOT0)
CH340C_RX: U8.17(PA9) U_USB.3(RXD)
CH340C_TX: U8.33(PA10) U_USB.2(TXD)
OUT1: FL1.C1(RFO_out) U7.1(OUTPUT1)
OUT2: FL1.C3(RFI_in) U7.3(OUTPUT2)
RFI_N: FL1.A2(RFI_N_out) U8.21(RFI_N)
RFI_P: FL1.A3(RFI_P_out) U8.20(RFI_P)
RFO_LP: C15.1 U8.22(RFO_LP)
RUNCAM_RX: J_CAM.4 U8.10(PA3)
RUNCAM_TX: J_CAM.5 U8.9(PA2)
SWD_CLK: J_SWD.3 U8.42(PA14)
SWD_IO: J_SWD.2 U8.36(PA13)
U_USB_D+: C45.1 J_USB.A6(DP1) J_USB.B6(DP2) U_USB.5(D+)
U_USB_D-: C46.1 J_USB.A7(DN1) J_USB.B7(DN2) U_USB.6(D-)
VCTL1: U7.4(VCTL2) U8.16(PA8)
VCTL2: U7.6(VCTL1) U8.15(PA7)
VR_PA: C13.2 C37.2 L3.2 U8.24(VR_PA)
Net-(C7-1): C7.1 C40.1 J_BAT1.2 J_BAT2.2 J_BAT3.2 J_BAT4.2 Q_BMS.3(S2) U6.4(VSS)
Net-(C7-2): C7.2 C38.2 J_BAT1.1 J_BAT2.1 J_BAT3.1 J_BAT4.1 J_PWRSWITCH.2 R10.2 U2.3(VBAT)
Net-(C15-2): C15.2 FL1.A1(RFO_in) L3.1
Net-(C29-2): C29.2 U_USB.4(V3)
Net-(C40-2): C40.2 R10.1 U6.5(BAT)
Net-(J_RF-1): J_RF.1(SIG) U7.5(INPUT)
Net-(J_USB-A5): J_USB.A5(CC1) R6.2
Net-(J_USB-B5): J_USB.B5(CC2) R7.2
Net-(L1-1): L1.1 U3.5(SW)
Net-(L_SMPS-1): L_SMPS.1 U8.47(VLXSMPS)
Net-(LED4-2): LED4.2(K) R_STAT.1
Net-(LED5-1): LED5.1(A) R8.1
Net-(LED6-1): LED6.1(A) R12.2
Net-(Q_BMS-4): Q_BMS.4(G2) U6.3(DOUT)
Net-(Q_BMS-6): Q_BMS.6(G1) U6.2(COUT)
Net-(R5-2): R5.2 U8.18(NRST)
Net-(R9-2): R9.2 U2.5(PROG)
Net-(R11-1): R11.1 U6.6(V-)
Net-(R13-2): R13.2 R_FB1.2 U3.1(FB)
Net-(R14-2): R14.2 R15.2 U3.2(EN)
Net-(R_STAT-2): R_STAT.2 U2.1(STAT)

Not connected (* = marked no-connect by the designer): J_USB A8(SBU1) B8(SBU2); Q_BMS 2(D1/D2) 5(D1/D2); SW1 3 4; U6 1(NC); U8 1(PB3) 2(PB4) 3(PB5) 4(PB6) 5(PB7) 6(PB8) 8(PA1) 12(PA4) 13(PA5) 14(PA6) 23(RFO_HP) 26(OSC_IN) 27(OSC_OUT) 30(PB0-VDD_TCXO) 31(PB2) 32(PB12) 34(PA11) 35(PA12) 38(PC13) 39(PC14-OSC32_IN) 40(PC15-OSC32_OUT) 43(PA15); U_USB 7(NC.) 8(OUT#) 9(CTS#) 10(DSR#) 11(RI#) 12(DCD#) 13(DTR#) 14(RTS#) 15(R232)

## Notes on the sheet
- MCU
- Battery Charging
- RF
- 3V3 Power
- Debug
- USBC and USB-to-Serial
- Camera Power
- JLC04161H-3313
